# EasyEDA Pro project mini mixer.epro

# Schematic Schematic1
Board Name: Board1; Create Date: 2025-08-09; Page Name: P1; Project Name: mini mixer; Schematic Name: Schematic1; Update Date: 2025-08-09; Company: EasyEDA.com; Page Size: A4; Version: V1.0
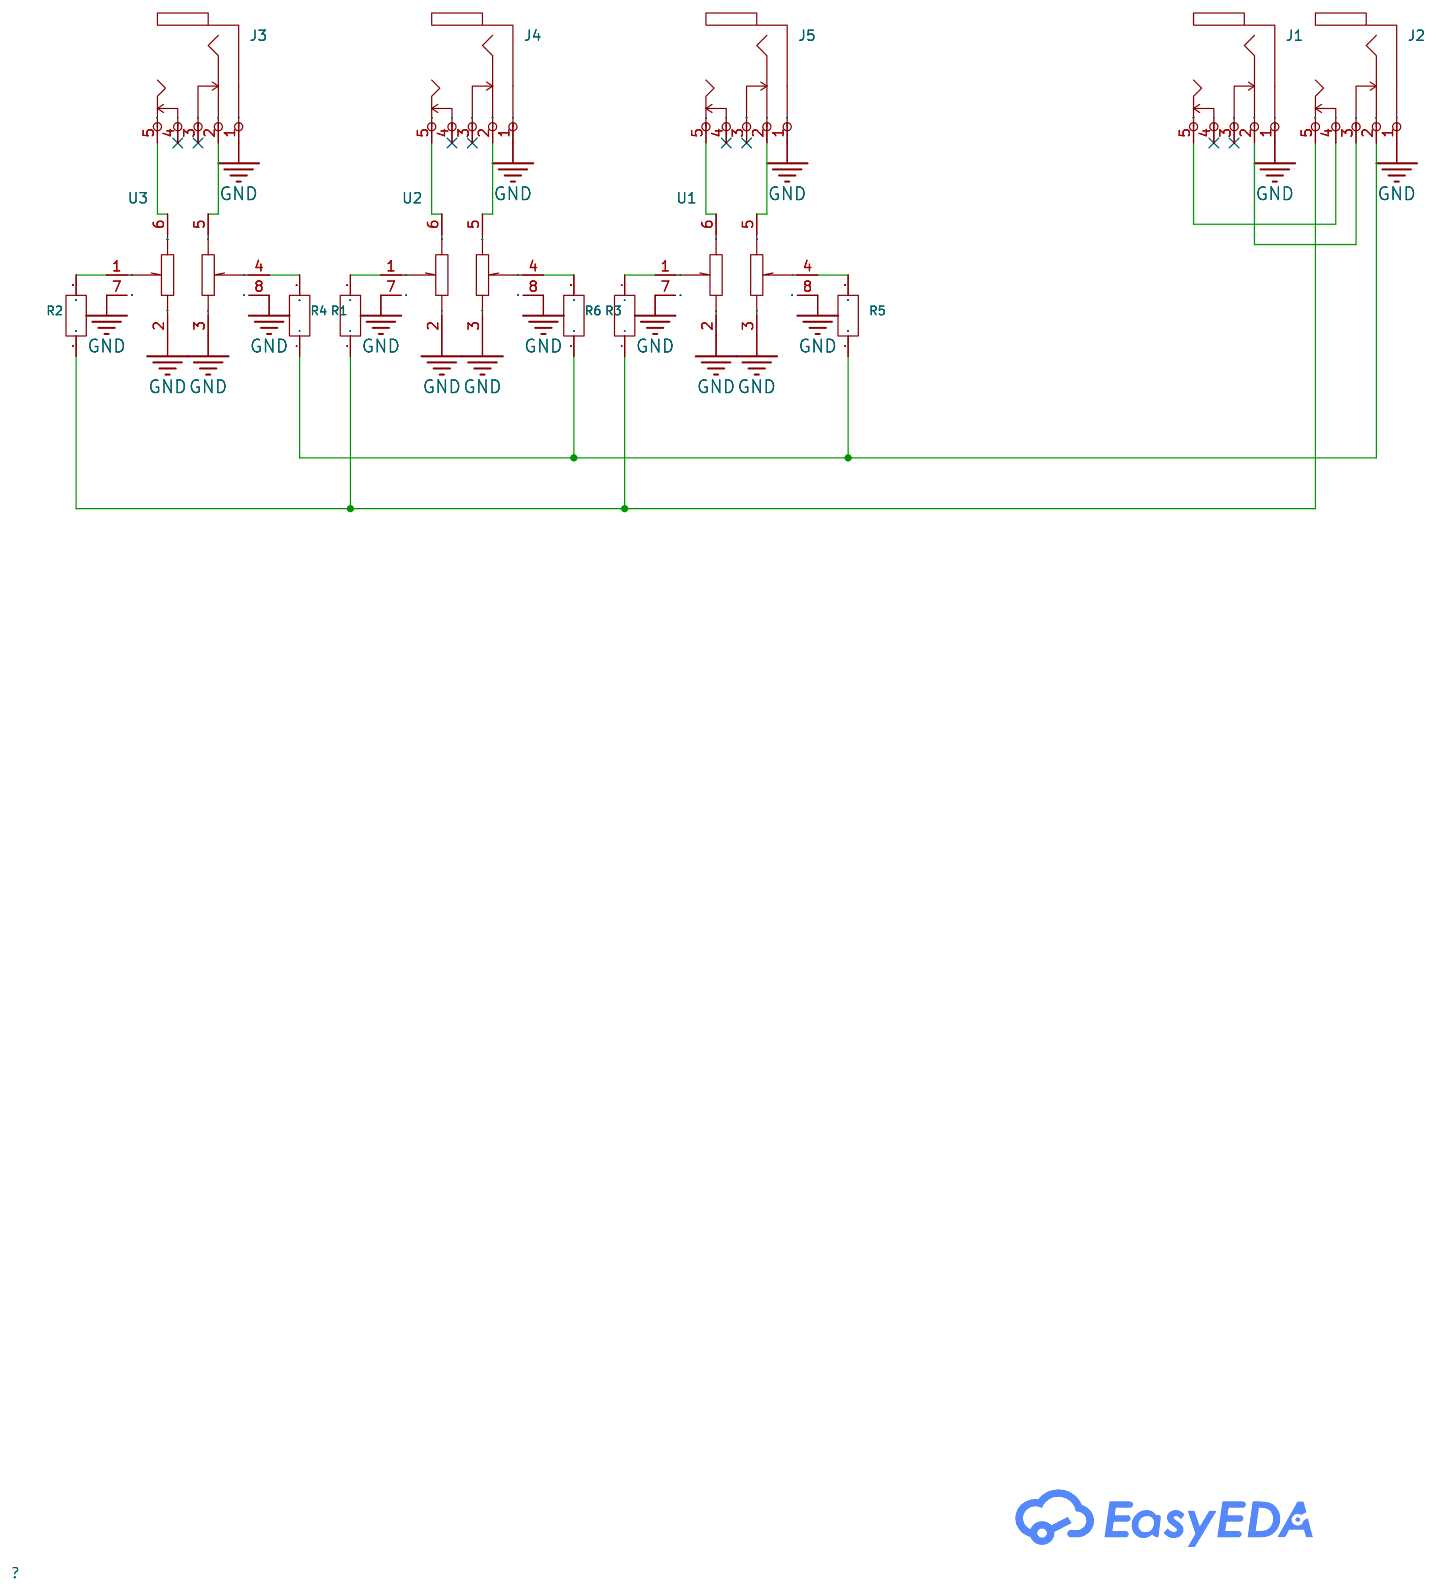
[diagram p0: schematic sheet]

## Parts
J1  PJ-307C  [AUDIO-TH_PJ307C]
J2  PJ-307C  [AUDIO-TH_PJ307C]
J3  PJ-307C  [AUDIO-TH_PJ307C]
J4  PJ-307C  [AUDIO-TH_PJ307C]
J5  PJ-307C  [AUDIO-TH_PJ307C]
R1  10kΩ  [R0603]
R2  10kΩ  [R0603]
R3  10kΩ  [R0603]
R4  10kΩ  [R0603]
R5  10kΩ  [R0603]
R6  10kΩ  [R0603]
U1  10kΩ  [RES-ADJ-TH_RK12L1230C1M]
U2  10kΩ  [RES-ADJ-TH_RK12L1230C1M]
U3  10kΩ  [RES-ADJ-TH_RK12L1230C1M]

## Library data of the parts
J1-J5 = PJ-307C: Connector Type:3.5mm耳机座 Current Rating (Max):500mA Voltage Rating (Max):30V; LCSC Part Name: 3.5mm耳机座; Supplier Part: C16684; Manufacturer: BOOMELE(博穆精密); Supplier Footprint: 插件; JLCPCB Part Class: Extended Part; Datasheet: https://atta.szlcsc.com/upload/public/pdf/source/20151024/1457707485399.pdf; Supplier: LCSC; Connector Type: 3.5mm耳机座; Current Rating (Max): 500mA; Voltage Rating (Max): 30V
R1-R6 = ERJUP3F1002V: Type:Thick Film Resistors Resistance:10kΩ Tolerance:±1% Tolerance:±1% Power(Watts): Overload Voltage (Max):- Temperature Coefficient:±100ppm/℃ Temperature Coefficient:±100ppm/℃ Operating Temperature Range:-55℃~+155℃ Operating Temperature Range:-55℃~+155℃; LCSC Part Name: 10kΩ ±1% 250mW 厚膜电阻; Supplier Part: C491211; Manufacturer: PANASONIC(松下); Supplier Footprint: 0603; JLCPCB Part Class: Extended Part; Datasheet: https://atta.szlcsc.com/upload/public/pdf/source/20200407/C491211_9E03BABF1D3334C0444FC6DE1274AD43.pdf; Supplier: LCSC; Type: Thick Film Resistors; Tolerance: ±1%; Temperature Coefficient: ±100ppm/℃; Operating Temperature Range: -55℃~+155℃
U1-U3 = RK12L12C0A0E: Resistance: Tolerance:±20% Tolerance:±20% Rated Voltage: Power(Watts):50mW Turns:-; LCSC Part Name: 10kΩ ±20%; Supplier Part: C470285; Manufacturer: ALPSALPINE(阿尔卑斯阿尔派); Supplier Footprint: 插件-6P,15.5x12mm; JLCPCB Part Class: Extended Part; Datasheet: https://atta.szlcsc.com/upload/public/pdf/source/20191216/C470380_93C0132B2AE7BA8B014CE4021E4797E4.pdf; Supplier: LCSC; Tolerance: ±20%; Power(Watts): 50mW

## Nets
GND: J1.1 J2.1 J3.1 J4.1 J5.1 U1.2 U1.3 U1.7(EH) U1.8(EH) U2.2 U2.3 U2.7(EH) U2.8(EH) U3.2 U3.3 U3.7(EH) U3.8(EH)
$1N810: J3.2 U3.5
$1N906: J3.5 U3.6
$1N1488: R2.2 U3.1
$1N1916: R4.2 U2.1
$1N1922: J4.5 U2.6
$1N1927: J4.2 U2.5
$1N2142: R6.2 U1.1
$1N2148: J5.5 U1.6
$1N2153: J5.2 U1.5
$1N2169: J2.5 R2.1 R4.1 R6.1
$1N2175: J2.2 R1.1 R3.1 R5.1
$1N2242: J1.5 J2.4
$1N2257: J1.2 J2.3
$1N3160: R5.2 U1.4
$1N3249: R3.2 U2.4
$1N3313: R1.2 U3.4

Not connected (* = marked no-connect by the designer): J1 3* 4*; J3 3* 4*; J4 3* 4*; J5 3* 4*

# Board PCB1
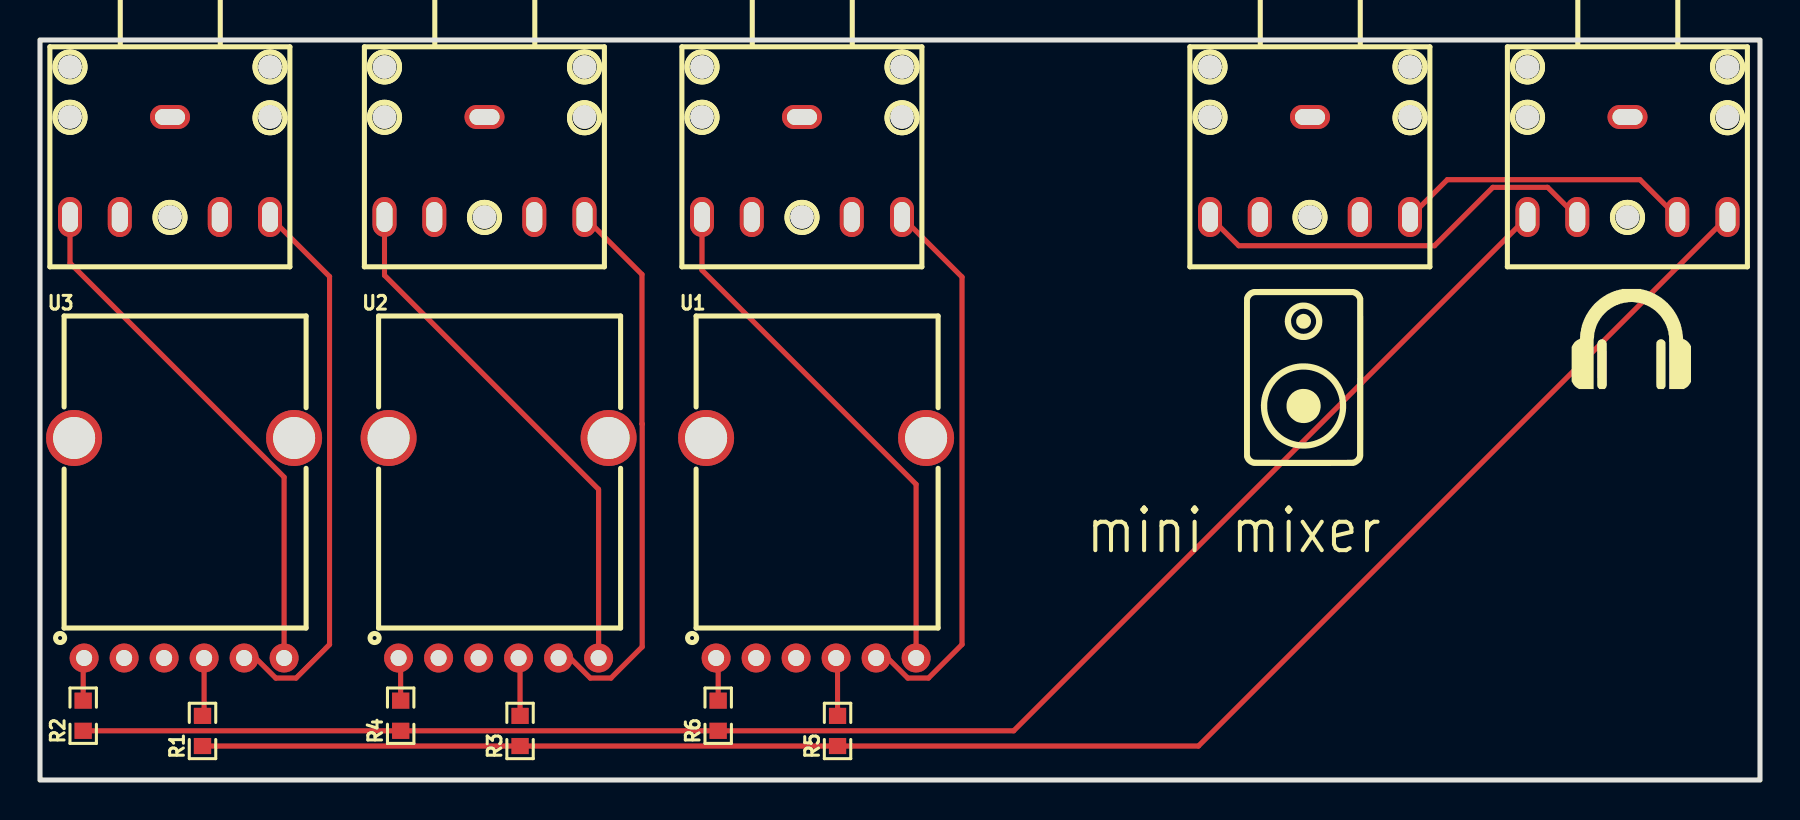
[diagram p1: board, top side]
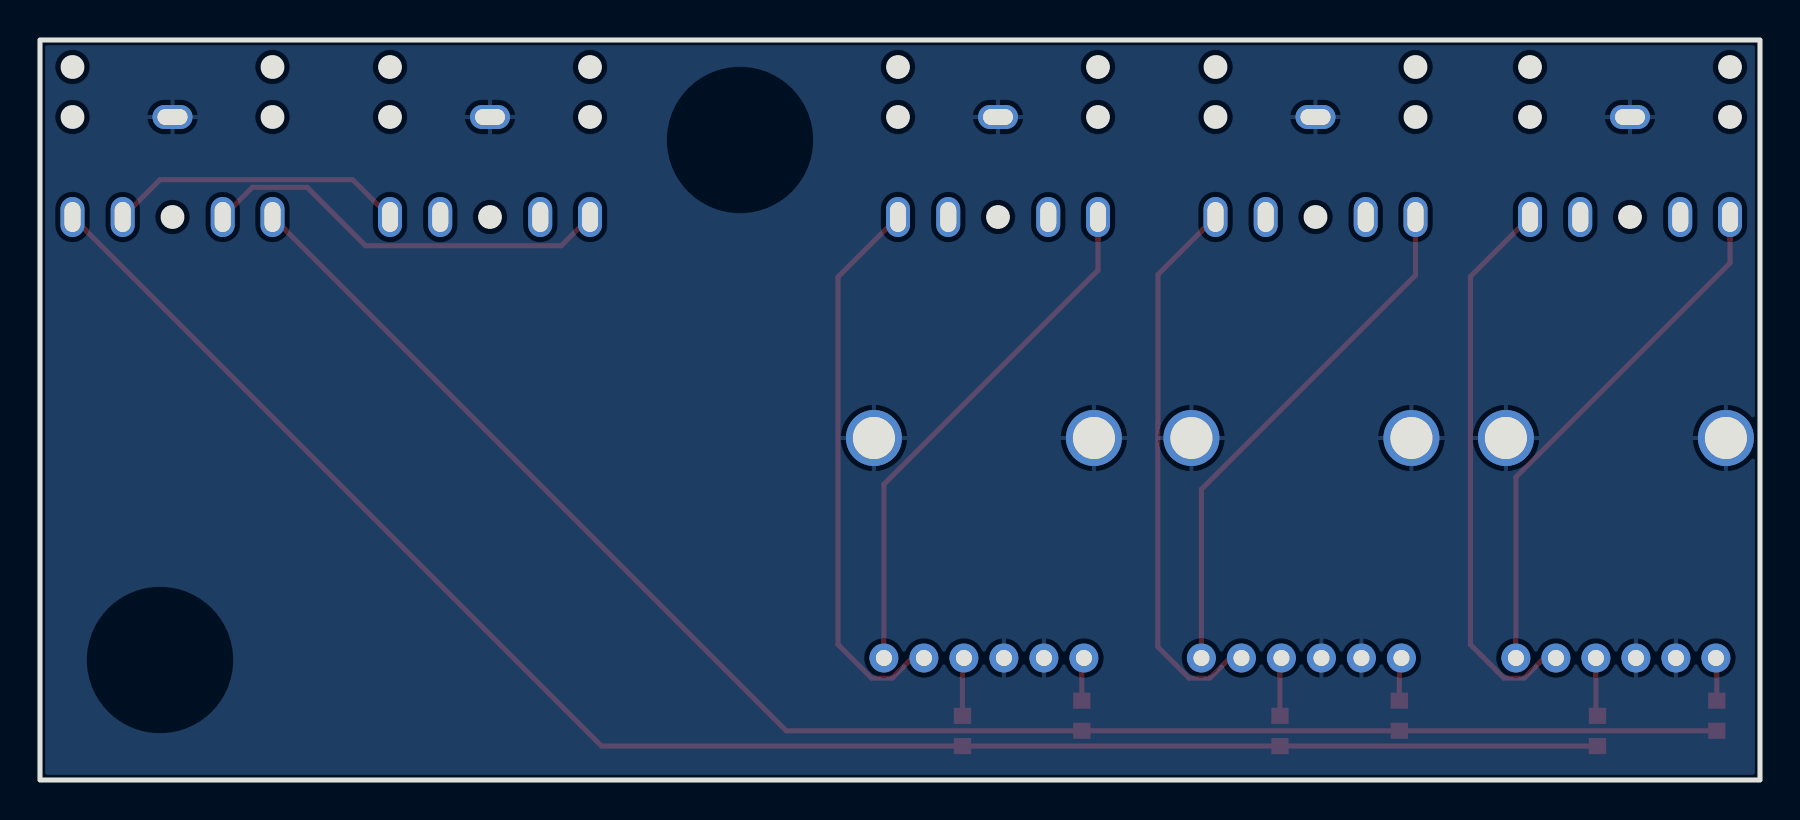
[diagram p2: board, bottom side, seen from below]

Outline 86 x 37 mm; copper layers: Top Layer, Bottom Layer. Coordinates in mm from the lower left corner of the outline.
Outline path: rectangle 0,37 86,0
Stack: Top Layer 0.035mm / Dielectric1 1.51mm FR4 er 4.5 / Bottom Layer 0.035mm

## Design rules (mm)
template: JLCPCB Capability(Two Layers Board)
spacing copperThickness1oz (default): track to track 0.102, other pairs 0.152 to 0.3
spacing copperThickness2oz: track to track 0.203, other pairs 0.152 to 0.3
track width copperThickness1oz (default): min 0.127, default 0.254, max 2.54
track width copperThickness2oz: min 0.203, default 0.254, max 2.54
differential pair differentialPair (default): width min 0.127, default 0.254, max 2.54; gap min 0.152, default 0.152
via viaSize (default): diameter min 0.5, default 0.61, max 10; hole min 0.3, default 0.305, max 6.3

## Placement (name value [footprint] x y rotation side)
J1  PJ-307C  [AUDIO-TH_PJ307C]  63.5 30.65 0 top
J2  PJ-307C  [AUDIO-TH_PJ307C]  79.38 30.65 0 top
J3  PJ-307C  [AUDIO-TH_PJ307C]  6.5 30.65 0 top
J4  PJ-307C  [AUDIO-TH_PJ307C]  22.22 30.65 0 top
J5  PJ-307C  [AUDIO-TH_PJ307C]  38.1 30.65 0 top
R1  10kΩ  [R0603]  8.13 2.45 90 top
R2  10kΩ  [R0603]  2.16 3.21 90 top
R3  10kΩ  [R0603]  24 2.45 90 top
R4  10kΩ  [R0603]  18.03 3.21 90 top
R5  10kΩ  [R0603]  39.88 2.45 90 top
R6  10kΩ  [R0603]  33.91 3.21 90 top
U1  10kΩ  [RES-ADJ-TH_RK12L1230C1M]  38.81 11.6 0 top
U2  10kΩ  [RES-ADJ-TH_RK12L1230C1M]  22.93 11.6 0 top
U3  10kΩ  [RES-ADJ-TH_RK12L1230C1M]  7.2 11.6 0 top

## Footprints (pads in the part's own frame, mm; a bottom-side part is the same pattern mirrored in y, then rotated)
AUDIO-TH_PJ307C
  oval 2x1.2 hole 1.5x0.8: 1(0,2.5)
  oval 1.2x2 hole 0.8x1.5: 2(5,-2.5) 3(2.489,-2.5) 4(-2.511,-2.5) 5(-5,-2.5)
R0603
  rect 0.806x0.864 smd: 1(-0.753,0) 2(0.753,0)
RES-ADJ-TH_RK12L1230C1M
  round 1.45 hole 0.8: 1(-5,-5.5) 2(-3,-5.5) 3(-1,-5.5) 4(1,-5.5) 5(3,-5.5) 6(5,-5.5)
  round 2.8 hole 2.1: 7(-5.5,5.5) 8(5.5,5.5)

## Nets
As in the schematic.

Pads without a net: J1 3 4; J3 3 4; J4 3 4; J5 3 4

## Routing (per net, layer and track width the routed paths; a pad name or vN(x,y) marks a point on that pad's centre or on a via; arc(x,y) is an arc through that point)
$1N810: length 28
  Top Layer w0.254: U3.5 10.78,6.1 11.79,5.1 12.8,5.1 14.48,6.77 14.48,25.17 J3.2
$1N906: length 26.5
  Top Layer w0.254: J3.5 1.5,25.85 12.2,15.14 U3.6
$1N1488: length 2.2
  Top Layer w0.254: U3.1 2.16,6.05 R2.2
$1N1916: length 2.2
  Top Layer w0.254: U2.1 18.03,6 R4.2
$1N1922: length 26.5
  Top Layer w0.254: U2.6 27.93,14.53 17.22,25.24 J4.5
$1N1927: length 27.9
  Top Layer w0.254: J4.2 30.1,25.28 30.1,17.81 30.11,17.8 30.11,6.66 28.55,5.1 27.51,5.1 26.51,6.1 U2.5
$1N2142: length 2.2
  Top Layer w0.254: R6.2 33.91,6 U1.1
$1N2148: length 26.5
  Top Layer w0.254: J5.5 33.1,25.49 43.8,14.79 U1.6
$1N2153: length 28
  Top Layer w0.254: J5.2 46.1,25.15 46.1,6.77 44.42,5.1 43.39,5.1 42.38,6.1 U1.5
$1N2169: length 82.9
  Top Layer w0.254: R2.1 R4.1 R6.1 48.69,2.46 J2.5
$1N2175: length 87.2
  Top Layer w0.254: R1.1 R3.1 R5.1 57.92,1.7 J2.2
$1N2242: length 20.8
  Top Layer w0.254: J2.4 75.38,29.63 72.64,29.63 69.72,26.71 59.94,26.71 J1.5
$1N2257: length 14.9
  Top Layer w0.254: J1.2 70.37,30.02 80,30.02 J2.3
$1N3160: length 2.9
  Top Layer w0.254: 39.88,3.2 39.88,6.03 U1.4
$1N3249: length 2.9
  Top Layer w0.254: U2.4 24,6.03 24,3.2
$1N3313: length 2.9
  Top Layer w0.254: 8.13,3.2 8.2,3.28 U3.4

## Copper pours and planes (outline as drawn; the poured copper is in the pictures)
GND on Bottom Layer: 0,37 86,37 86,0 0,0

## Text on the board
Top Silkscreen Layer: mini mixer
